# Altium schematic sheet BMS-S07-V01-PSU.SchDoc: Power Supply (20-40V to 3v3 @ 0.1-0.6A)
size A3; DrawnBy: Jonn Dillon; DocumentNumber: 10; Revision: 01; SheetNumber: 10; SheetTotal: 10; Version: 01; Project: Battery Management System 2020; PageSetup: Record=PageOptions|CenterHorizontal=True|CenterVertical=True|PrintScale=0.97|XCorrection=1.00|YCorrection=1.00|PrintKind=0|BorderSize=5000000|LeftOffset=0|BottomOffset=0|Orientation=2|PaperLength=1000|PaperWidth=1000|Scale=100|PaperSource=7|PrintQuality=-4|MediaType=1|DitherType=10|PaperKind=A4|PrintScaleMode=1
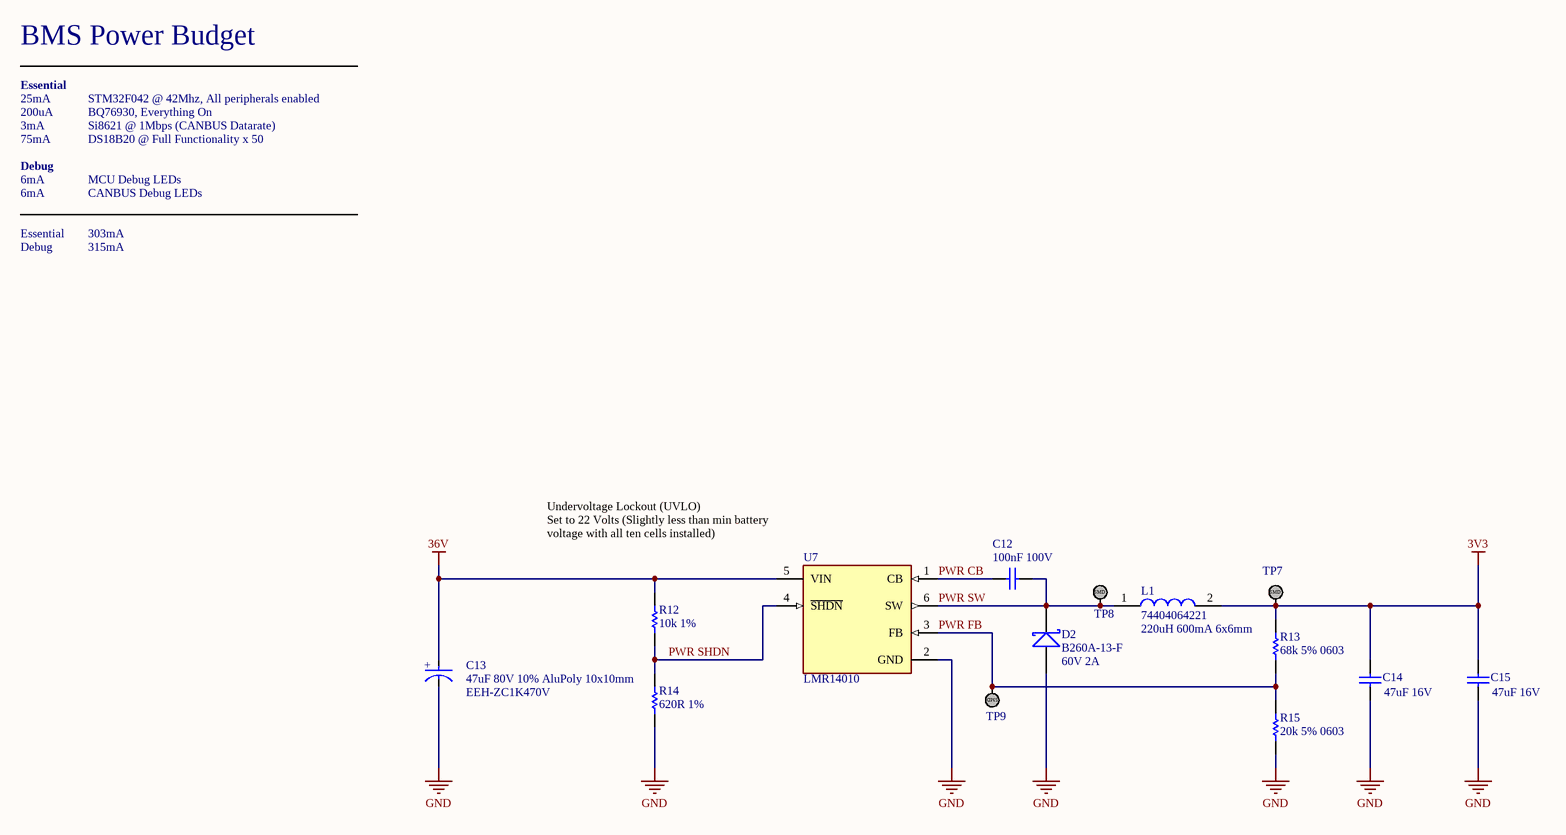
[diagram p0: BMS-S07-V01-PSU.SchDoc]

## Parts
C12  100nF 100V  [Cap_Ceramic_0603]
C13  47uF 80V 10% AluPoly 10x10mm  [CAP_ALU_10x10mm]
C14  47uF 16V  [Cap_Ceramic_1210]
C15  47uF 16V  [Cap_Ceramic_1210]
D2  B260A-13-F  [SMA]
L1  74404064221  [Inductor_6x6mm]
R12  10k 1%  [Res_ThinFilm_0603]
R13  68k 5% 0603  [Res_ThinFilm_0603]
R14  620R 1%  [Res_ThinFilm_0603]
R15  20k 5% 0603  [Res_ThinFilm_0603]
TP7  TestPoint_SMD  [TestPointSMD]  (value not drawn)
TP8  TestPoint_SMD  [TestPointSMD]  (value not drawn)
TP9  TestPoint_SMD  [TestPointSMD]  (value not drawn)
U7  LMR14010  [LMR14010]

## Nets
3V3: C14.2 C15.2 L1.2 R13.2 TP7.1
36V: C13.A R12.2 U7.5(VIN)
GND: C13.K C14.1 C15.1 D2.A R14.1 R15.1 U7.2(GND)
PWR CB: C12.1 U7.1(CB)
PWR FB: R13.1 R15.2 TP9.1 U7.3(FB)
PWR SHDN: R12.1 R14.2 U7.4(~{SHDN})
PWR SW: C12.2 D2.K L1.1 TP8.1 U7.6(SW)

## Notes on the sheet
- BMS Power Budget
- 25mA
- 200uA
- Essential
- STM32F042 @ 42Mhz, All peripherals enabled
- BQ76930, Everything On
- 3mA
- 6mA
- Debug
- 75mA
- Si8621 @ 1Mbps (CANBUS Datarate)
- MCU Debug LEDs
- DS18B20 @ Full Functionality x 50
- CANBUS Debug LEDs
- 303mA
- 315mA
- Undervoltage Lockout (UVLO)
  Set to 22 Volts (Slightly less than min battery voltage with all ten cells installed)
- (near L1) 220uH 600mA 6x6mm
- (near C13) EEH-ZC1K470V
- (near D2) 60V 2A
- Revision History:
- Sheet Title:
- Rev
- Date
- Description
- Project:
- Size:
- Drawn By:
- A3
- Number:
- Revision:
- Sheet
- Version:
- of
- QUT Motorsport
- O-120, Gardens Point
- 2 George Street
- Brisbane, QLD 4000
- Australia
- Print Date:
- Print Time:
- File Name:
- (in symbol 47uF 80V 10% AluPoly 10x10mm) +
- (in symbol TestPoint_SMD) SMD

## Library data of the parts
C12 = 100nF 100V 5% X7R 0603: Capacitor, Ceramic, SMD, 100nF, 100V, 5%, X7R, 0603
C13 = 47uF 80V 10% AluPoly 10x10mm: Capacitor, AluPoly, SMD, 47uF, 80V, 10%, AluPoly, 10x10mm
C14 C15 = 47uF 16V 10% X7R 1210: Capacitor, Ceramic, SMD, 47uF, 16V, 5%, X7R, 1210
D2 = B260A-13-F: Diode, Schottky Barrier Rectifier, 60 V, 2 A, B260A-13-F
L1 = 74404064221: FIXED IND 220UH 660MA 850 MOHM; ComponentLink1Description: Digikey; ComponentLink1URL: https://www.digikey.com.au/product-detail/en/w%C3%BCrth-elektronik/74404064221/732-7261-1-ND/5353241; ComponentLink2Description: LCSC A; ComponentLink2URL: https://lcsc.com/product-detail/Power-Inductors_Sunlord-SWPA6045S221MT_C91047.html; ComponentLink3Description: LCSC B; ComponentLink3URL: https://lcsc.com/product-detail/Power-Inductors_SXN-Shun-Xiang-Nuo-Elec-SMNR6045-221MT_C467145.html
R12 = 10k 1% 0603: Resistor, SMD, 10k, 0.1W, 1%, 0603
R13 = 68k 5% 0603: Resistor, SMD, 68k, 0.1W, 5%, 0603
R14 = 620R 1% 0603: Resistor, SMD, 680R, 0.1W, 5%, 0603
R15 = 20k 5% 0603: Resistor, SMD, 20k, 0.1W, 5%, 0603